# Altium schematic sheet 新主控板.SchDoc
size A3
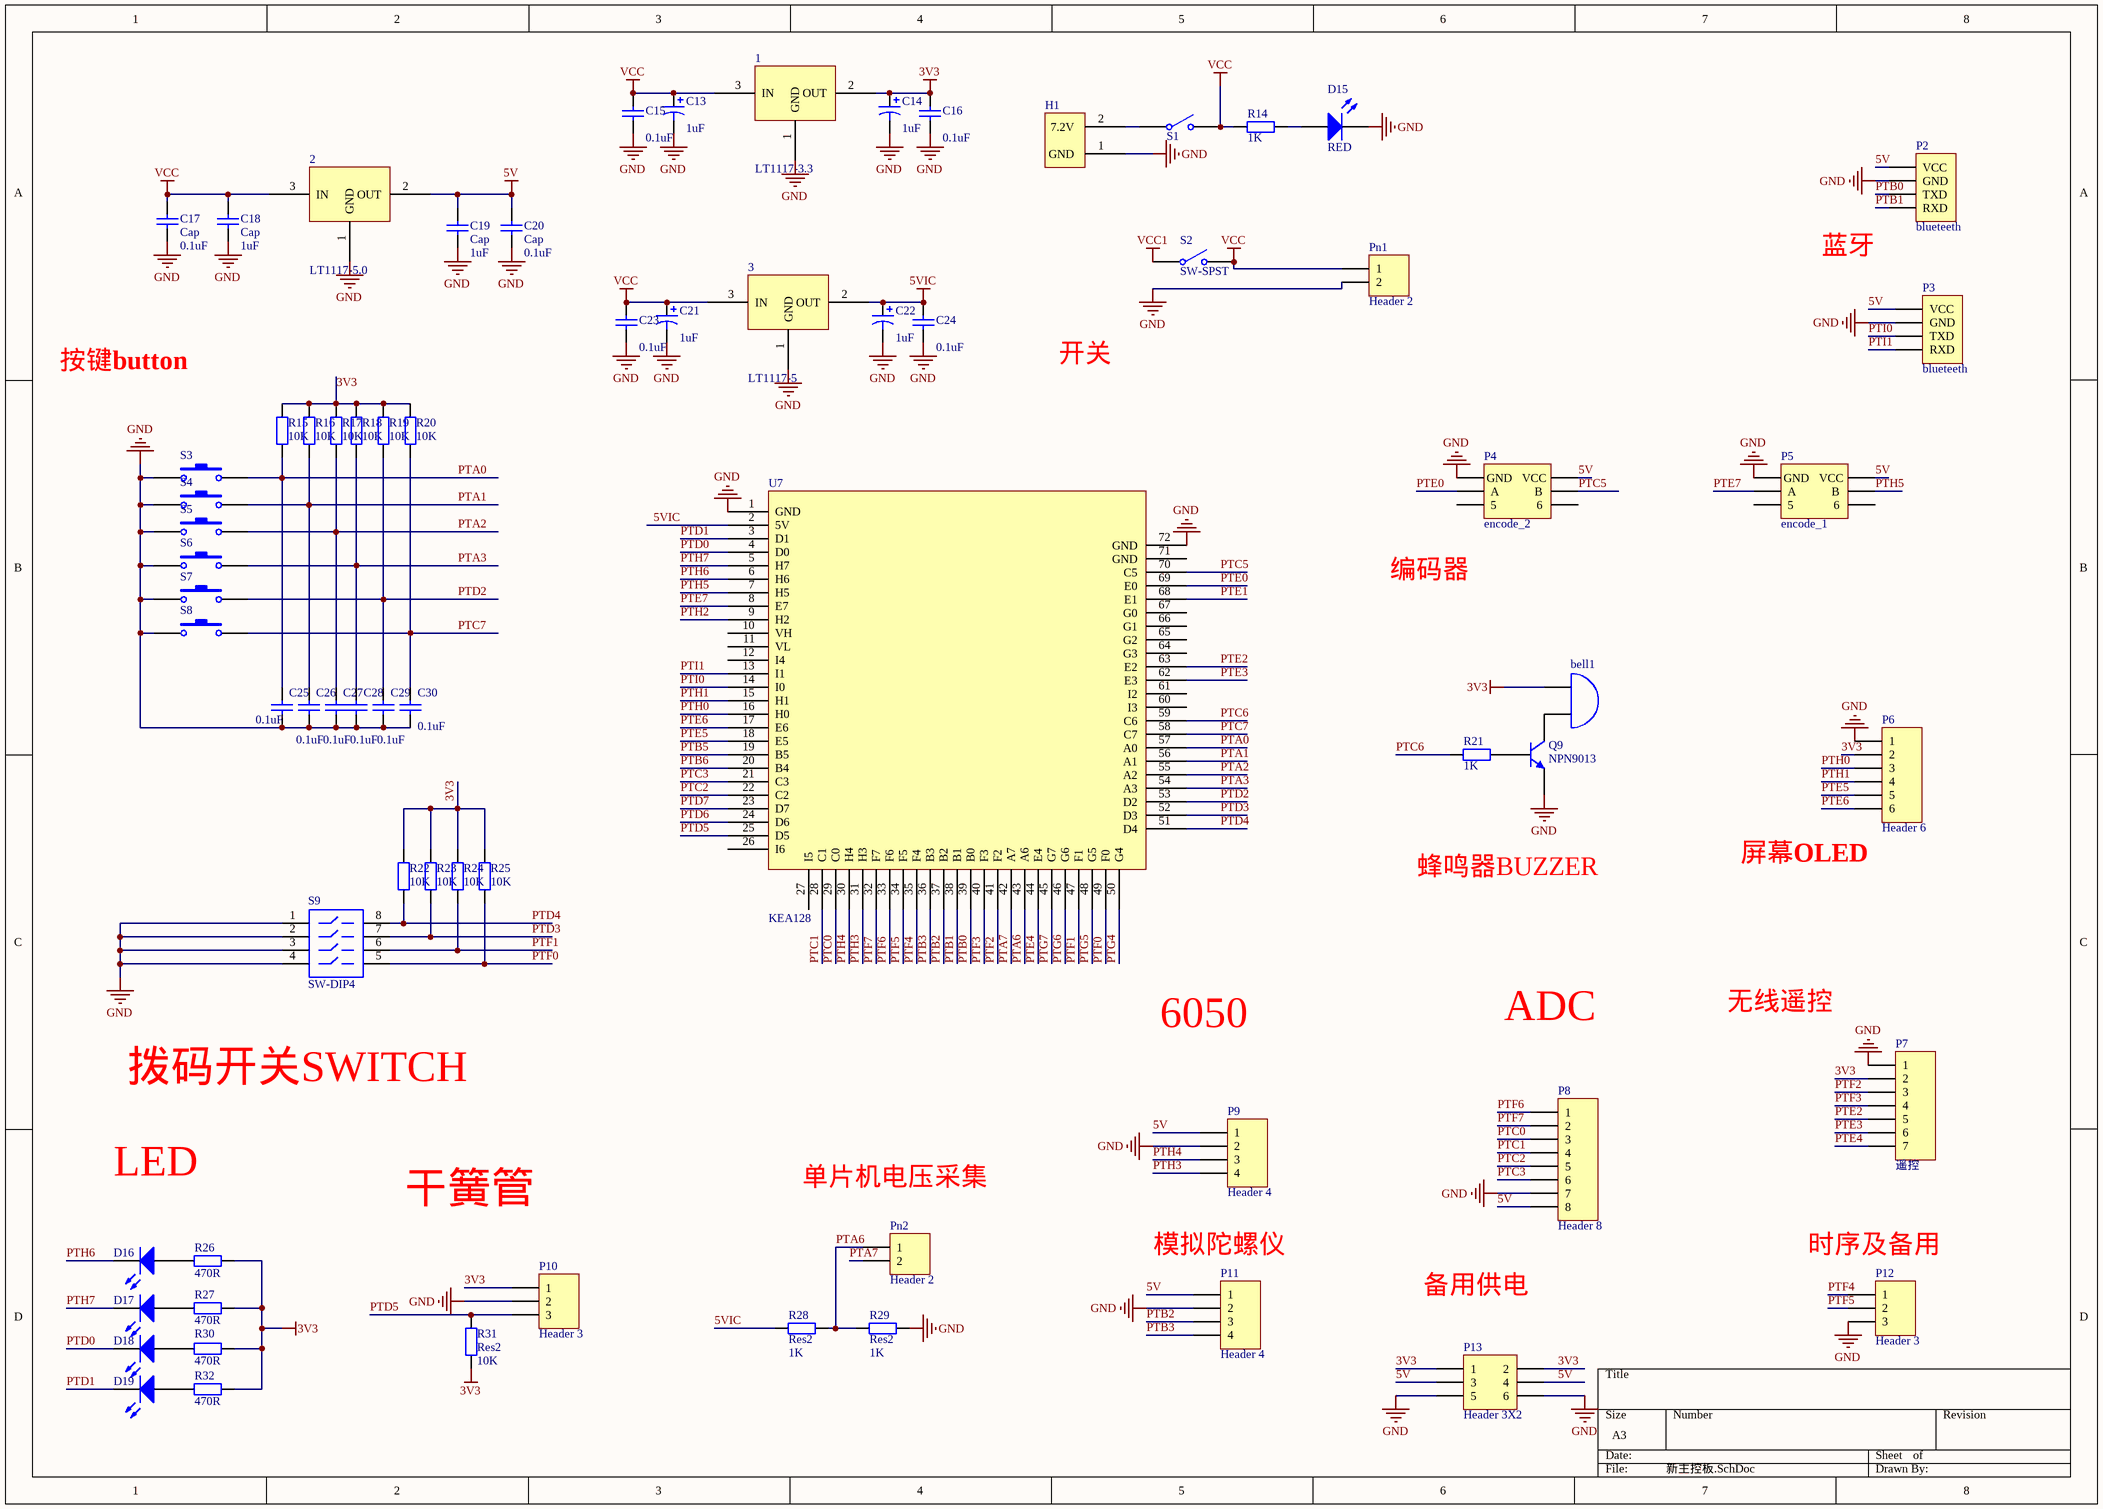
[diagram p0: 新主控板.SchDoc]

## Parts
1  LT1117-3.3  [1117]
2  LT1117-5.0  [1117]
3  LT1117-5  [1117]
bell1  Bell  [470uF]  (value not drawn)
C13  value 1uF  [0805(2012)]  (hidden comment: Cap Pol1)
C14  value 1uF  [0805(2012)]  (hidden comment: Cap Pol1)
C15  value 0.1uF  [0805(2012)]  (hidden comment: Cap)
C16  value 0.1uF  [0805(2012)]  (hidden comment: Cap)
C17  Cap  value 0.1uF  [0805(2012)]
C18  Cap  value 1uF  [0805(2012)]
C19  Cap  value 1uF  [0805(2012)]
C20  Cap  value 0.1uF  [0805(2012)]
C21  value 1uF  [0805(2012)]  (hidden comment: Cap Pol1)
C22  value 1uF  [0805(2012)]  (hidden comment: Cap Pol1)
C23  value 0.1uF  [0805(2012)]  (hidden comment: Cap)
C24  value 0.1uF  [0805(2012)]  (hidden comment: Cap)
C25  value 0.1uF  [0805(2012)]  (hidden comment: Cap)
C26  value 0.1uF  [0805(2012)]  (hidden comment: Cap)
C27  value 0.1uF  [0805(2012)]  (hidden comment: Cap)
C28  value 0.1uF  [0805(2012)]  (hidden comment: Cap)
C29  value 0.1uF  [0805(2012)]  (hidden comment: Cap)
C30  value 0.1uF  [0805(2012)]  (hidden comment: Cap)
D15  RED  [0805LED]
D16  LED0  [0805LED]  (value not drawn)
D17  LED0  [0805LED]  (value not drawn)
D18  LED0  [0805LED]  (value not drawn)
D19  LED0  [0805LED]  (value not drawn)
H1  H1  [KF301-2P]  (value not drawn)
P2  blueteeth  [HDR1X4]
P3  blueteeth  [HDR1X4]
P4  encode_2  [HDR2X3]
P5  encode_1  [HDR2X3]
P6  Header 6  [HDR1X6]
P7  遥控  [HDR1X7]
P8  Header 8  [HDR1X8]
P9  Header 4  [HDR1X4]
P10  Header 3  [HDR1X3]
P11  Header 4  [HDR1X4]
P12  Header 3  [HDR1X3]
P13  Header 3X2  [HDR2X3]
Pn1  Header 2  [HDR1X2]
Pn2  Header 2  [HDR1X2]
Q9  NPN9013  [TO-226-AE]
R14  value 1K  [0805(2012)]  (hidden comment: Res2)
R15  value 10K  [0805(2012)]  (hidden comment: Res2)
R16  value 10K  [0805(2012)]  (hidden comment: Res2)
R17  value 10K  [0805(2012)]  (hidden comment: Res2)
R18  value 10K  [0805(2012)]  (hidden comment: Res2)
R19  value 10K  [0805(2012)]  (hidden comment: Res2)
R20  value 10K  [0805(2012)]  (hidden comment: Res2)
R21  value 1K  [0805(2012)]  (hidden comment: Res2)
R22  value 10K  [0805(2012)]  (hidden comment: Res2)
R23  value 10K  [0805(2012)]  (hidden comment: Res2)
R24  value 10K  [0805(2012)]  (hidden comment: Res2)
R25  value 10K  [0805(2012)]  (hidden comment: Res2)
R26  value 470R  [0805(2012)]  (hidden comment: Res2)
R27  value 470R  [0805(2012)]  (hidden comment: Res2)
R28  Res2  value 1K  [0805(2012)]
R29  Res2  value 1K  [0805(2012)]
R30  value 470R  [0805(2012)]  (hidden comment: Res2)
R31  Res2  value 10K  [0805(2012)]
R32  value 470R  [0805(2012)]  (hidden comment: Res2)
S1  SW-SPST  [SWICH_3]  (value not drawn)
S2  SW-SPST  [SWICH_3]
S3  SW-PB  [PCBComponent_1]  (value not drawn)
S4  SW-PB  [PCBComponent_1]  (value not drawn)
S5  SW-PB  [PCBComponent_1]  (value not drawn)
S6  SW-PB  [PCBComponent_1]  (value not drawn)
S7  SW-PB  [PCBComponent_1]  (value not drawn)
S8  SW-PB  [PCBComponent_1]  (value not drawn)
S9  SW-DIP4  [DIP-8]
U7  KEA128  [KEA128_BOARD]

## Nets
3V3: 1.2(OUT) bell1.1(A) C14.1 C16.2 P6.2 P7.2 P10.1 P13.1 P13.2 R15.2 R16.2 R17.2 R18.2 R19.2 R20.2 R22.2 R23.2 R24.2 R25.2 R26.2 R27.2 R30.2 R31.1 R32.2
5V: 2.2(OUT) C19.2 C20.2 P2.1(VCC) P3.1(VCC) P4.2(VCC) P5.2(VCC) P8.8 P9.1 P11.1 P13.3 P13.4
5VIC: 3.2(OUT) C22.1 C24.2 R28.1 U7.2(5V)
GND: 1.1(GND) 2.1(GND) 3.1(GND) C13.2 C14.2 C15.1 C16.1 C17.1 C18.1 C19.1 C20.1 C21.2 C22.2 C23.1 C24.1 C25.1 C26.1 C27.1 C28.1 C29.1 C30.1 D15.2(K) H1.1(GND) P2.2(GND) P3.2(GND) P4.1(GND) P5.1(GND) P6.1 P7.1 P8.7 P9.2 P10.2 P11.2 P12.3 P13.5 P13.6 Pn1.2 Q9.1(E) R29.2 S3.1 S4.1 S5.1 S6.1 S7.1 S8.1 S9.1 S9.2 S9.3 S9.4 U7.1(GND) U7.72(GND)
VCC: 1.3(IN) 2.3(IN) 3.3(IN) C13.1 C15.2 C17.2 C18.2 C21.1 C23.2 Pn1.1 R14.2 S1.2(NO) S2.2(NO)
VCC1: S2.1(COMMON)
PTA0: C25.2 R15.1 S3.2 U7.57(A0)
PTA1: C26.2 R16.1 S4.2 U7.56(A1)
PTA2: C27.2 R17.1 S5.2 U7.55(A2)
PTA3: C28.2 R18.1 S6.2 U7.54(A3)
PTA6: Pn2.1 R28.2 R29.1 U7.43(A6)
PTA7: Pn2.2 U7.42(A7)
PTB0: P2.3(TXD) U7.39(B0)
PTB1: P2.4(RXD) U7.38(B1)
PTB2: P11.3 U7.37(B2)
PTB3: P11.4 U7.36(B3)
PTB5: U7.19(B5)
PTB6: U7.20(B4)
PTC0: P8.3 U7.29(C0)
PTC1: P8.4 U7.28(C1)
PTC2: P8.5 U7.22(C2)
PTC3: P8.6 U7.21(C3)
PTC5: P4.4(B) U7.70(C5)
PTC6: R21.1 U7.59(C6)
PTC7: C30.2 R20.1 S8.2 U7.58(C7)
PTD0: D18.2(K) U7.4(D0)
PTD1: D19.2(K) U7.3(D1)
PTD2: C29.2 R19.1 S7.2 U7.53(D2)
PTD3: R23.1 S9.7 U7.52(D3)
PTD4: R22.1 S9.8 U7.51(D4)
PTD5: P10.3 R31.2 U7.25(D5)
PTD6: U7.24(D6)
PTD7: U7.23(D7)
PTE0: P4.3(A) U7.69(E0)
PTE1: U7.68(E1)
PTE2: P7.5 U7.63(E2)
PTE3: P7.6 U7.62(E3)
PTE4: P7.7 U7.44(E4)
PTE5: P6.5 U7.18(E5)
PTE6: P6.6 U7.17(E6)
PTE7: P5.3(A) U7.8(E7)
PTF0: R25.1 S9.5 U7.49(F0)
PTF1: R24.1 S9.6 U7.47(F1)
PTF2: P7.3 U7.41(F2)
PTF3: P7.4 U7.40(F3)
PTF4: P12.1 U7.35(F4)
PTF5: P12.2 U7.34(F5)
PTF6: P8.1 U7.33(F6)
PTF7: P8.2 U7.32(F7)
PTG4: U7.50(G4)
PTG5: U7.48(G5)
PTG6: U7.46(G6)
PTG7: U7.45(G7)
PTH0: P6.3 U7.16(H0)
PTH1: P6.4 U7.15(H1)
PTH2: U7.9(H2)
PTH3: P9.4 U7.31(H3)
PTH4: P9.3 U7.30(H4)
PTH5: P5.4(B) U7.7(H5)
PTH6: D16.2(K) U7.6(H6)
PTH7: D17.2(K) U7.5(H7)
PTI0: P3.3(TXD) U7.14(I0)
PTI1: P3.4(RXD) U7.13(I1)
Netbell1_2: bell1.2(B) Q9.3(C)
NetD15_1: D15.1(A) R14.1
NetD16_1: D16.1(A) R26.1
NetD17_1: D17.1(A) R27.1
NetD18_1: D18.1(A) R30.1
NetD19_1: D19.1(A) R32.1
NetH1_2: H1.2(7.2V) S1.1(COMMON)
NetQ9_2: Q9.2(B) R21.2

Not connected (* = marked no-connect by the designer): P4 5 6; P5 5 6; U7 10(VH) 11(VL) 12(I4) 26(I6) 27(I5) 60(I3) 61(I2) 64(G3) 65(G2) 66(G1) 67(G0) 71(GND)

## Notes on the sheet
- 蓝牙
- 按键button
- 开关
- 编码器
- 蜂鸣器BUZZER
- 屏幕OLED
- 6050
- ADC
- 无线遥控
- 拨码开关SWITCH
- LED
- 单片机电压采集
- 干簧管
- (near P11) 模拟陀螺仪
- (near P12) 时序及备用
- 备用供电

## Library data of the parts
2 3 = LT1117-3.3
bell1 = Bell: Electrical Bell; Published: 24-Mar-1999; LatestRevisionDate: 17-Jul-2002; LatestRevisionNote: Re-released for DXP Platform.; PackageReference: PIN2; Publisher: Altium Limited
C13 C14 C21 C22 = Cap Pol1: Polarized Capacitor (Radial); Published: 8-Jun-2000; LatestRevisionDate: 17-Jul-2002; LatestRevisionNote: Re-released for DXP Platform.; PackageReference: RB7.6-15; Publisher: Altium Limited; PackageDescription: Polarized Capacitor (Radial); 2 Leads
C15-C20 C23-C30 = Cap: Capacitor; Published: 8-Jun-2000; LatestRevisionDate: 17-Jul-2002; LatestRevisionNote: Re-released for DXP Platform.; PackageReference: RAD-0.3; Publisher: Altium Limited; PackageDescription: Radial Cap, Thru-Hole; 2 Leads; 0.3 in Pin Spacing
D15 = LED2: Typical RED, GREEN, YELLOW, AMBER GaAs LED; Published: 8-Jun-2000; LatestRevisionDate: 17-Jul-2002; LatestRevisionNote: Re-released for DXP Platform.; PackageVersion: Feb-2002; PackageReference: 3.2X1.6X1.1; Publisher: Altium Limited; PackageDescription: SM LED; 2 Flat Leads
D16-D19 = LED0: Typical INFRARED GaAs LED; Published: 8-Jun-2000; LatestRevisionDate: 08-Jul-2005; LatestRevisionNote: Mech Layer 1 removed.; PackageReference: LED-0; Publisher: Altium Limited; PackageDescription: LED; 2 Leads
P4 P5 = encode
P6 = Header 6: Header, 6-Pin; LatestRevisionDate: 17-Jul-2002; LatestRevisionNote: Re-released for DXP Platform.; Publisher: Altium Limited
P7 = MHDR1X7: Header, 7-Pin; LatestRevisionDate: 17-Jul-2002; LatestRevisionNote: Re-released for DXP Platform.; Publisher: Altium Limited
P8 = Header 8: Header, 8-Pin; LatestRevisionDate: 17-Jul-2002; LatestRevisionNote: Re-released for DXP Platform.; Publisher: Altium Limited
P9 P11 = Header 4: Header, 4-Pin; LatestRevisionDate: 17-Jul-2002; LatestRevisionNote: Re-released for DXP Platform.; Publisher: Altium Limited
P10 P12 = Header 3: Header, 3-Pin; LatestRevisionDate: 17-Jul-2002; LatestRevisionNote: Re-released for DXP Platform.; Publisher: Altium Limited
P13 = Header 3X2: Header, 3-Pin, Dual row; LatestRevisionDate: 17-Jul-2002; LatestRevisionNote: Re-released for DXP Platform.; Publisher: Altium Limited
Pn1 Pn2 = Header 2: Header, 2-Pin; LatestRevisionDate: 17-Jul-2002; LatestRevisionNote: Re-released for DXP Platform.; Publisher: Altium Limited
Q9 = 2N3904: NPN General Purpose Amplifier; Published: 8-Jun-2000; LatestRevisionDate: 15-Jan-2003; LatestRevisionNote: PCB Footprint 'BCY-W3/D4.7' replaced; DatasheetVersion: 1997; PackageVersion: Sep-1998; PackageReference: TO-92A; Publisher: Altium Limited; PackageDescription: TO, Flat Index; 3 In-Line, Axial Leads; Body Dia. 4.5mm; Leads 0.51 x 0.48 mm (max); ComponentLink1Description: Manufacturer Link; ComponentLink1URL: http://www.fairchildsemi.com/; ComponentLink2Description: Datasheet; ComponentLink2URL: http://www.fairchildsemi.com/ds/2N%2F2N3904.pdf
R14-R32 = Res2: Resistor; Published: 8-Jun-2000; LatestRevisionDate: 17-Jul-2002; LatestRevisionNote: Re-released for DXP Platform.; PackageReference: AXIAL-0.4; Publisher: Altium Limited; PackageDescription: Axial Device, Thru-Hole; 2 Leads; 0.4 in Pin Spacing
S1 S2 = SW-SPST: Single-Pole, Single-Throw Switch; Published: 24-Mar-1999; LatestRevisionDate: 17-Jul-2002; LatestRevisionNote: Re-released for DXP Platform.; PackageReference: SPST-2; Publisher: Altium Limited; PackageDescription: Switch; 2 Leads
S3-S8 = SW-PB: Switch; Published: 24-Mar-1999; LatestRevisionDate: 17-Jul-2002; LatestRevisionNote: Re-released for DXP Platform.; PackageReference: SPST-2; Publisher: Altium Limited; PackageDescription: Switch; 2 Leads
S9 = SW-DIP4: DIP Switch; Published: 24-Mar-1999; LatestRevisionDate: 17-Jul-2002; LatestRevisionNote: Re-released for DXP Platform.; PackageReference: DIP-8; Publisher: Altium Limited